# Altium project buck_automotive.PrjPcb
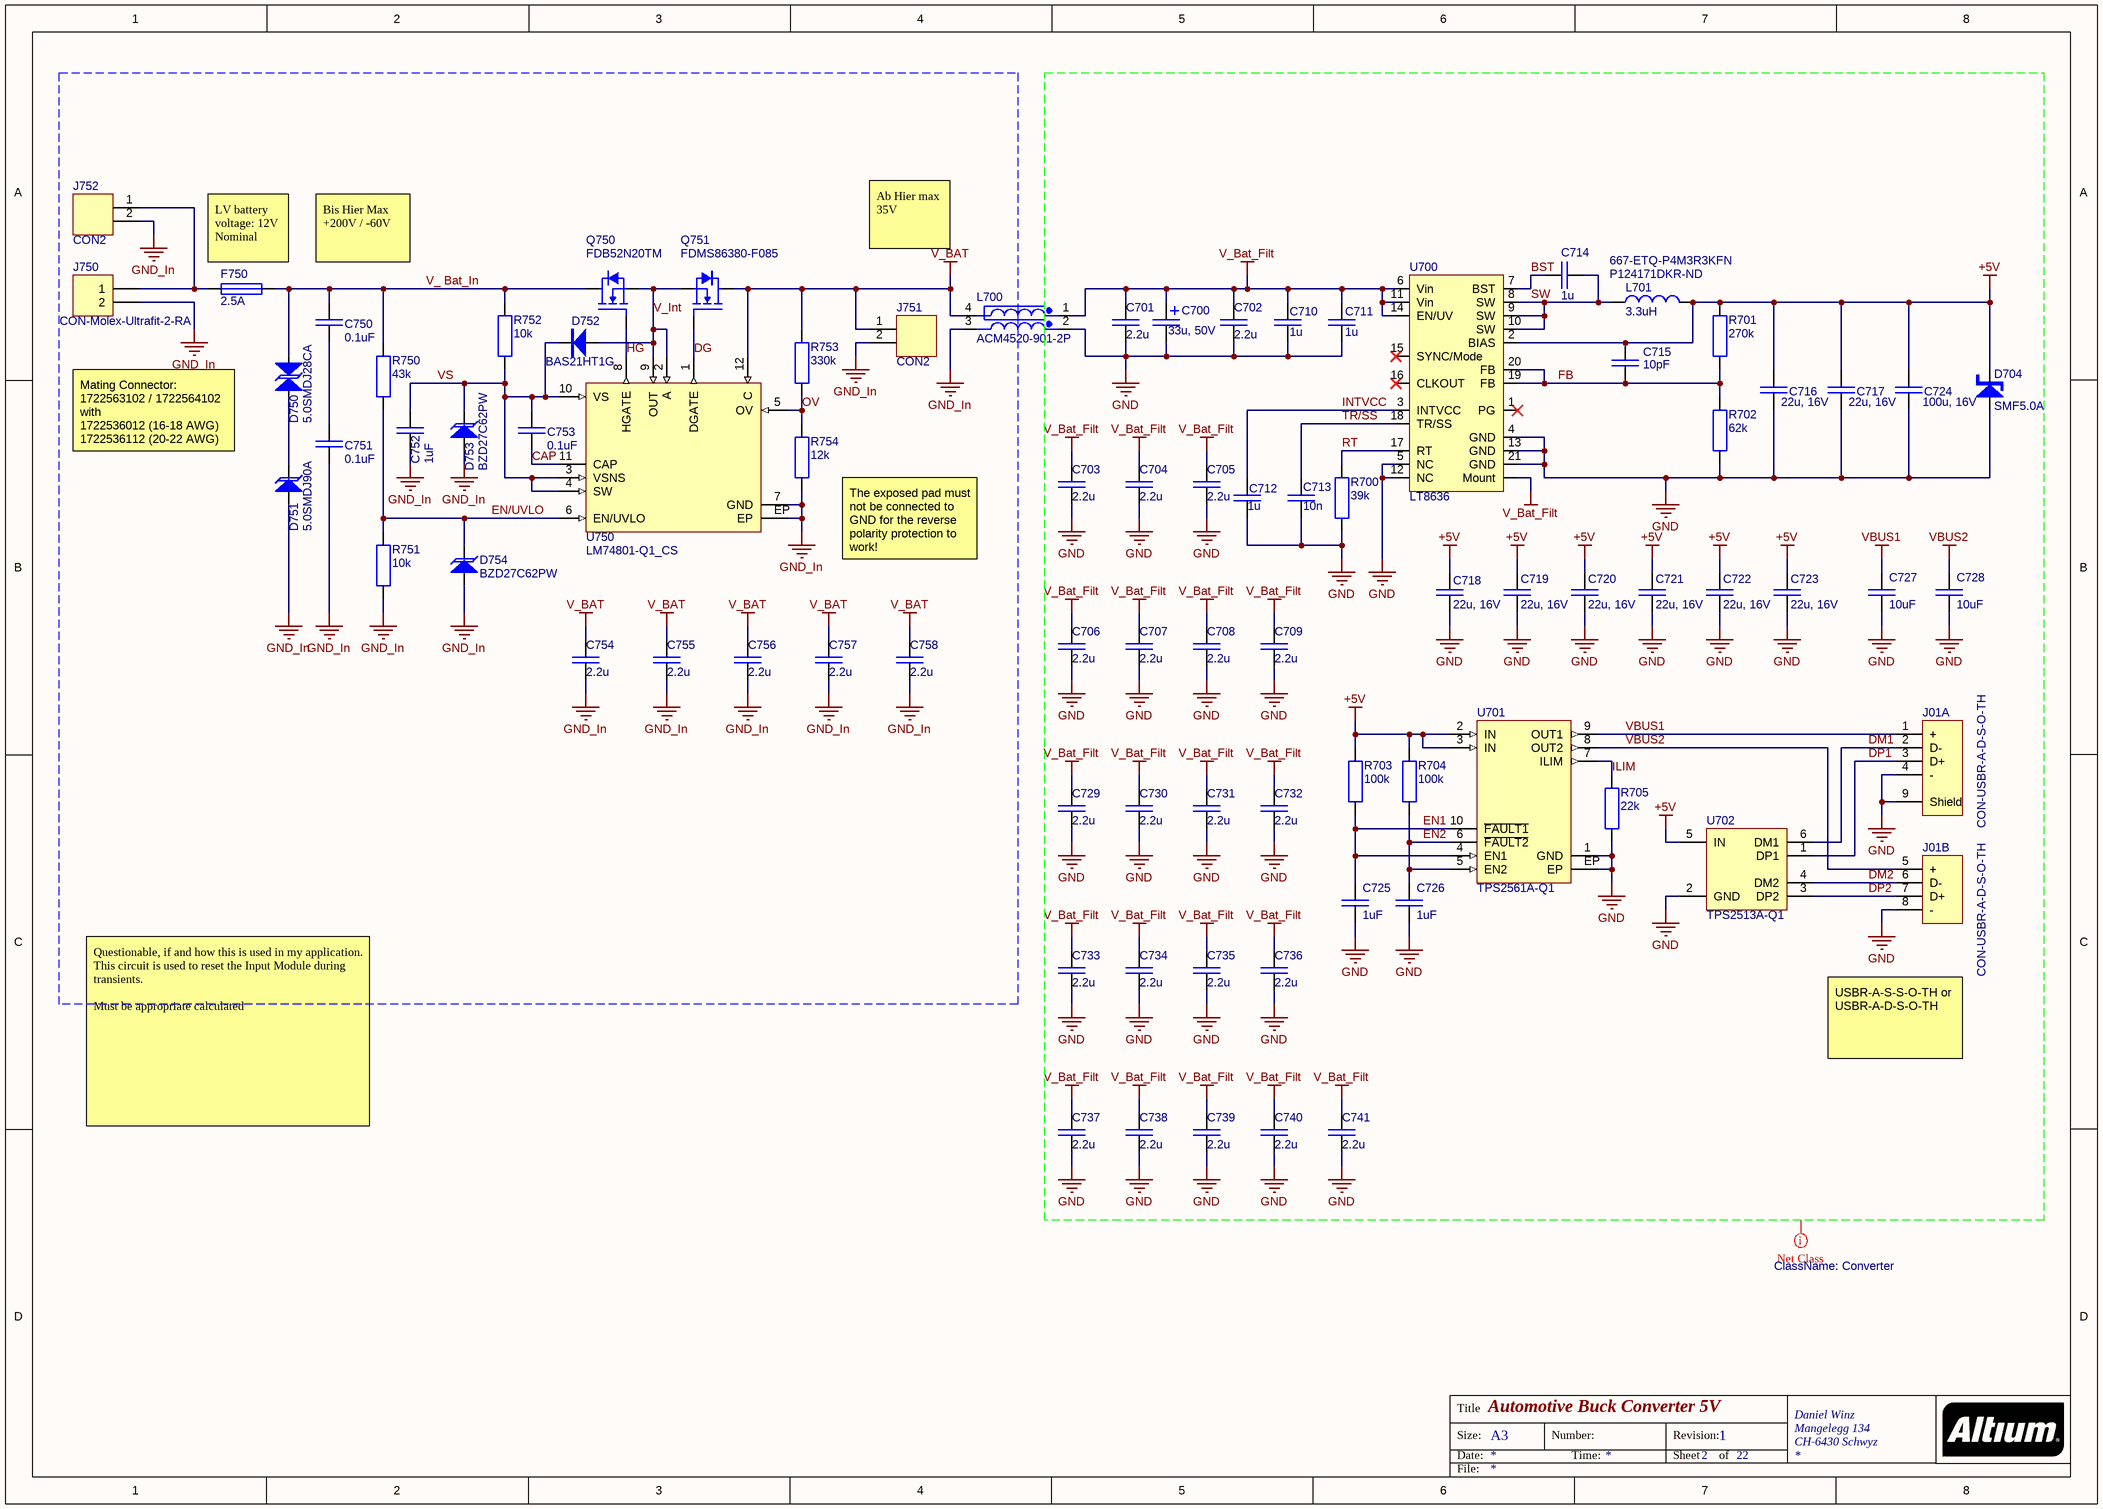
[diagram p0: buck_automotive.SchDoc]
1 sheet, 81 parts. Net scope: global (net labels, ports and power ports of the same name join across sheets).
Board file: buck_automotive.PcbDoc

## Sheet buck_automotive.SchDoc: Automotive Buck Converter 5V
size A3; Author: Daniel Winz; DrawnBy: aho; Address1: Daniel Winz; Address2: Mangelegg 134; Address3: CH-6430 Schwyz; Revision: 1; SheetNumber: 2; SheetTotal: 22; ProjectName: i1_prototyp_0

### Parts
C700  33u, 50V  [C_ELKO_SMD_6.6x6.6_7.7]
C701  2.2u  [C_0805_S]
C702  2.2u  [C_0805_S]
C703  2.2u  [C_0805_S]
C704  2.2u  [C_0805_S]
C705  2.2u  [C_0805_S]
C706  2.2u  [C_0805_S]
C707  2.2u  [C_0805_S]
C708  2.2u  [C_0805_S]
C709  2.2u  [C_0805_S]
C710  1u  [C_0603_S]
C711  1u  [C_0603_S]
C712  1u  [C_0603_S]
C713  10n  [C_0603_S]
C714  1u  [C_0603_S]
C715  10pF  [C_0603_S]
C716  22u, 16V  [C_1210_S]
C717  22u, 16V  [C_1210_S]
C718  22u, 16V  [C_1210_S]
C719  22u, 16V  [C_1210_S]
C720  22u, 16V  [C_1210_S]
C721  22u, 16V  [C_1210_S]
C722  22u, 16V  [C_1210_S]
C723  22u, 16V  [C_1210_S]
C724  100u, 16V  [C_ELKO_SMD_5.3X5.3_5.4]
C725  1uF  [C_0603_S]
C726  1uF  [C_0603_S]
C727  10uF  [C_0805_S]
C728  10uF  [C_0805_S]
C729  2.2u  [C_0805_S]
C730  2.2u  [C_0805_S]
C731  2.2u  [C_0805_S]
C732  2.2u  [C_0805_S]
C733  2.2u  [C_0805_S]
C734  2.2u  [C_0805_S]
C735  2.2u  [C_0805_S]
C736  2.2u  [C_0805_S]
C737  2.2u  [C_0805_S]
C738  2.2u  [C_0805_S]
C739  2.2u  [C_0805_S]
C740  2.2u  [C_0805_S]
C741  2.2u  [C_0805_S]
C750  0.1uF  [C_1206_S]
C751  0.1uF  [C_1206_S]
C752  1uF  [C_0603_S]
C753  0.1uF  [C_0603_S]
C754  2.2u  [C_0805_S]
C755  2.2u  [C_0805_S]
C756  2.2u  [C_0805_S]
C757  2.2u  [C_0805_S]
C758  2.2u  [C_0805_S]
D704  SMF5.0A  [SOD123FL]
D750  5.0SMDJ28CA  [DO-214AB]
D751  5.0SMDJ90A  [DO-214AB]
D752  BAS21HT1G  [SOD-323]
D753  BZD27C62PW  [SOD123W]
D754  BZD27C62PW  [SOD123W]
F750  2.5A  [Littelfuse 157serie]
J01  CON-USBR-A-D-S-O-TH  [CON-USBR-A-D-S-O-TH]  (parts A,B of 2)
J750  CON-Molex-Ultrafit-2-RA  [CON-MOLEX-ULTRAFIT-172310-1X02]
J751  CON2  [HEADER_2_RM_2.54]
J752  CON2  [HEADER_2_RM_2.54]
L700  ACM4520-901-2P  [ACM4520-2P]
L701  3.3uH  Supplier Part Number 1: P124171DKR-ND  Supplier Part Number 2: 667-ETQ-P4M3R3KFN  [4020]
Q750  FDB52N20TM  [TO-263-3-2]
Q751  FDMS86380-F085  [SON5x6]
R700  39k  [R_0603_S]
R701  270k  [R_0603_S]
R702  62k  [R_0603_S]
R703  100k  [R_0603_S]
R704  100k  [R_0603_S]
R705  22k  [R_0603_S]
R750  43k  [R_0603_S]
R751  10k  [R_0603_S]
R752  10k  [R_0603_S]
R753  330k  [R_0603_S]
R754  12k  [R_0603_S]
U700  LT8636  [LQFN_20_4x3]
U701  TPS2561A-Q1  [SON50P300X300X100-10-EP_TI-DRC010J]
U702  TPS2513A-Q1  [SOT23-6P95_300X305X145L60]
U750  LM74801-Q1_CS  [SON50P300X300X80-12-EP250X130X]

### Nets
+5V: C715.2 C716.1 C717.1 C718.1 C719.1 C720.1 C721.1 C722.1 C723.1 C724.1 D704.K L701.2 R701.1 R703.1 R704.1 U700.2(BIAS) U701.2(IN) U701.3(IN) U702.5(IN)
GND: C700.2 C701.2 C702.2 C703.2 C704.2 C705.2 C706.2 C707.2 C708.2 C709.2 C710.1 C711.1 C712.2 C713.1 C716.2 C717.2 C718.2 C719.2 C720.2 C721.2 C722.2 C723.2 C724.2 C725.1 C726.1 C727.1 C728.1 C729.2 C730.2 C731.2 C732.2 C733.2 C734.2 C735.2 C736.2 C737.2 C738.2 C739.2 C740.2 C741.2 D704.A J01.4(-) J01.8(-) J01.9(Shield) L700.2 R700.1 R702.2 R705.2 U700.4(GND) U700.5(NC) U700.12(NC) U700.13(GND) U700.21(GND) U701.1(GND) U701.EP U702.2(GND)
GND_In: C751.2 C752.1 C754.2 C755.2 C756.2 C757.2 C758.2 D751.A D753.A D754.A J750.2 J751.2 J752.2 L700.3 R751.2 R754.2 U750.7(GND) U750.EP
V_BAT: C754.1 C755.1 C756.1 C757.1 C758.1 J751.1 L700.4 Q751.D(DRAIN) R753.1 U750.12(C)
V_Bat_Filt: C700.1 C701.1 C702.1 C703.1 C704.1 C705.1 C706.1 C707.1 C708.1 C709.1 C710.2 C711.2 C729.1 C730.1 C731.1 C732.1 C733.1 C734.1 C735.1 C736.1 C737.1 C738.1 C739.1 C740.1 C741.1 L700.1 U700.6(Vin) U700.11(Vin) U700.14(EN/UV) U700.M(Mount)
VBUS1: C727.2 J01.1(+) U701.9(OUT1)
VBUS2: C728.2 J01.5(+) U701.8(OUT2)
BST: C714.1 U700.7(BST)
CAP: C753.2 U750.11(CAP)
DG: Q751.G(GATE) U750.1(DGATE)
DM1: J01.2(D-) U702.6(DM1)
DM2: J01.6(D-) U702.4(DM2)
DP1: J01.3(D+) U702.1(DP1)
DP2: J01.7(D+) U702.3(DP2)
EN1: C725.2 R703.2 U701.4(EN1) U701.10(~{FAULT1})
EN2: C726.2 R704.2 U701.5(EN2) U701.6(~{FAULT2})
EN/UVLO: D754.K R750.2 R751.1 U750.6(EN/UVLO)
FB: C715.1 R701.2 R702.1 U700.19(FB) U700.20(FB)
HG: Q750.1(GATE) U750.8(HGATE)
ILIM: R705.1 U701.7(ILIM)
INTVCC: C712.1 U700.3(INTVCC)
OV: R753.2 R754.1 U750.5(OV)
RT: R700.2 U700.17(RT)
SW: C714.2 L701.1 U700.8(SW) U700.9(SW) U700.10(SW)
TR/SS: C713.2 U700.18(TR/SS)
V_ Bat_In: C750.1 D750.A F750.2 Q750.2(DRAIN) R750.1 R752.1
V_Int: D752.A Q750.3(SOURCE) Q751.S(SOURCE) U750.2(A) U750.9(OUT)
VS: C752.2 C753.1 D752.K D753.K R752.2 U750.3(VSNS) U750.4(SW) U750.10(VS)
NetC750_2: C750.2 C751.1
NetD750_K: D750.K D751.K
NetF750_1: F750.1 J750.1 J752.1

Not connected (* = marked no-connect by the designer): U700 1(PG)* 15(SYNC/Mode)* 16(CLKOUT)*

### Layout directives
net class Converter: +5V, BST, DM1, DM2, DP1, DP2, EN1, EN2, FB, GND, ILIM, INTVCC, RT, SW, TR/SS, V_Bat_Filt, VBUS1, VBUS2
net class Protection: CAP, DG, EN/UVLO, GND_In, HG, OV, V_ Bat_In, V_BAT, V_Int, VS

### Notes on the sheet
- Ab Hier max 35V
- (near F750) LV battery voltage: 12V Nominal
- Bis Hier Max +200V / -60V
- Mating Connector:
  1722563102 / 1722564102
  with
  1722536012 (16-18 AWG)
  1722536112 (20-22 AWG)
- (near R754) The exposed pad must not be connected to GND for the reverse polarity protection to work!
- USBR-A-S-S-O-TH or
  USBR-A-D-S-O-TH
- Questionable, if and how this is used in my application.
  This circuit is used to reset the Input Module during transients.
  Must be appropriate calculated
- Title
- Size:
- Date:
- A3
- Number:
- Time:
- Revision:
- Sheet
- of
- File:

### Library data of the parts
C700 = C_Elko: ComponentLink1URL: http://uk.rs-online.com/webdocs/0f49/0900766b80f4973e.pdf; ComponentLink1Description: http://uk.rs-online.com/webdocs/0f49/0900766b80f4973e.pdf; ComponentLink2URL: https://www.distrelec.biz/Web/Downloads/_t/ds/smd_ft_eng_tds.pdf?mime=application%2Fpdf; ComponentLink2Description: https://www.distrelec.biz/Web/Downloads/_t/ds/smd_ft_eng_tds.pdf?mime=application%2Fpdf; ComponentLink3URL: http://www.farnell.com/datasheets/1244238.pdf; ComponentLink3Description: http://www.farnell.com/datasheets/1244238.pdf; ComponentLink4URL: http://www.farnell.com/datasheets/1898066.pdf; ComponentLink4Description: http://www.farnell.com/datasheets/1898066.pdf; ComponentLink5URL: http://www.farnell.com/datasheets/1790597.pdf; ComponentLink5Description: http://www.farnell.com/datasheets/1790597.pdf; ComponentLink6URL: http://www.mouser.com/ds/2/315/ABA0000C573-947481.pdf; ComponentLink6Description: http://www.mouser.com/ds/2/315/ABA0000C573-947481.pdf; ComponentLink7URL: http://industrial.panasonic.com/www-data/pdf/ABA0000/ABA0000CE135.pdf; ComponentLink7Description: http://industrial.panasonic.com/www-data/pdf/ABA0000/ABA0000CE135.pdf; Supplier 1: Digi-Key; Supplier Part Number 1: P123715CT-ND; Supplier 2: Mouser; Supplier Part Number 2: 667-EEH-ZC1H330XV
C701-C709 C729-C741 C754-C758 = C: 0805, 50V; Supplier 1: Digi-Key; Supplier Part Number 1: 587-4963-1-ND; Supplier 2: Mouser; Supplier Part Number 2: 963-UMK212BB7225MG-T
C710-C715 = C: 0603, >25V
C716-C723 = C: 10V 0805; Supplier 1: Digi-Key; Supplier Part Number 1: 1276-6801-1-ND; Supplier 2: Mouser; Supplier Part Number 2: 187-CL32B226KOJVPJE
C724 = C: 10V ELKO; Supplier 1: Digi-Key; Supplier Part Number 1: P124157CT-ND; Supplier 2: Mouser; Supplier Part Number 2: 667-16SVPK100M
C725 C726 C752 C753 = C
C727 C728 = C: 0805
C750 C751 = C: 100V
D704 = Schottky
D750 = TVS_BI: Supplier 1: Mouser; Supplier Part Number 1: 576-5.0SMDJ22A; Supplier 2: Digi-Key; Supplier Part Number 2: 18-5.0SMDJ22ACT-ND
D751 D753 D754 = TVS
  D751: Supplier 1: Mouser; Supplier Part Number 1: 576-5.0SMDJ22A; Supplier 2: Digi-Key; Supplier Part Number 2: 18-5.0SMDJ22ACT-ND
  D753 D754: Supplier 1: Digi-Key; Supplier Part Number 1: BZD27C62PWCT-ND
D752 = D?: Diode; Supplier 1: Mouser; Supplier Part Number 1: 863-BAS21HT1G; Supplier 2: Digi-Key; Supplier Part Number 2: BAS21HT1GOSCT-ND
F750 = FUSE: Supplier 1: Digi-Key; Supplier Part Number 1: F2965CT-ND; Supplier 2: Mouser; Supplier Part Number 2: 576-015702.5DR
J01 = CON-USBR-A-D-S-O-TH: Samtec USBR-A-D-S-O-TH; Supplier 1: Digi-Key; Supplier Part Number 1: SAM10377-ND; Supplier 2: Mouser; Supplier Part Number 2: 200-USBRADSOTH
J750 = CON-Molex-Ultrafit-2-RA: Molex Ultrafit 2 pin Right-angle; Supplier 1: Digi-Key; Supplier Part Number 1: WM11825-ND; Supplier 2: Mouser; Supplier Part Number 2: 538-172310-1302
L700 = L_2ph_cm_small: 2 Phase Common Mode Choke; Supplier 1: Digi-Key; Supplier Part Number 1: 445-6137-1-ND; Supplier 2: Digi-Key; Supplier Part Number 2: 445-6137-6-ND; Supplier 3: Mouser; Supplier Part Number 3: 810-ACM45209012PT000
L701 = L: Inductor; Supplier 1: Digi-Key; Supplier 2: Mouser
Q750 Q751 = MOSFET N
  Q750: Supplier 1: Digi-Key; Supplier Part Number 1: FDB52N20TMCT-ND; Supplier 2: Mouser; Supplier Part Number 2: 512-FDB52N20TM
  Q751: Supplier 1: Mouser; Supplier Part Number 1: 512-FDMS86380_F085; Supplier 2: Digi-Key; Supplier Part Number 2: FDMS86380-F085CT-ND
R700-R705 = R?: Normaler Widerstand
R750-R754 = R: Normaler Widerstand
U700 = LT8636: 42V, 5A/7A Peak Synchronous Step-Down Silent Switcher with 2.5μA Quiescent Current; HelpURL: https://www.mouser.ch/datasheet/2/609/LT8636-1674249.pdf; ComponentLink1Description: Datasheet; ComponentLink1URL: https://www.mouser.ch/datasheet/2/609/LT8636-1674249.pdf; Supplier 1: Digi-Key; Supplier 2: Mouser; Supplier Part Number 1: 161-LT8636EV#PBF-ND; Supplier Part Number 2: 584-LT8636EV#PBF
U701 = TPS2561A-Q1: TPS2561A-Q1 Dual Channel Precision Automotive Adjustable Current-Limited Power Switches; Supplier 1: Mouser; Supplier Part Number 1: 595-TPS2561AQDRCRQ1; Supplier 2: Digi-Key; Supplier Part Number 2: 296-TPS2561AQDRCTQ1CT-ND; Supplier 3: Mouser; Supplier Part Number 3: 595-TPS2561AQDRCTQ1
U702 = TPS2513A-Q1: TPS2513A-Q1 USB Dedicated Charging Port Controller; Supplier 1: Mouser; Supplier Part Number 1: 595-TPS2513AQDBVRQ1; Supplier 2: Digi-Key; Supplier Part Number 2: 296-TPS2513AQDBVTQ1CT-ND
U750 = LM74801-Q1_CS: LM74801-Q1 - Ideal Diode Controller with Load Dump Protection / Pin placement for common source application; Supplier 1: Digi-Key; Supplier Part Number 1: 296-LM74801QDRRRQ1CT-ND; Supplier 2: Mouser; Supplier Part Number 2: 595-LM74801QDRRRQ1